# EAGLE design SSOP to DIP 28 pin (EAGLE 5.06)
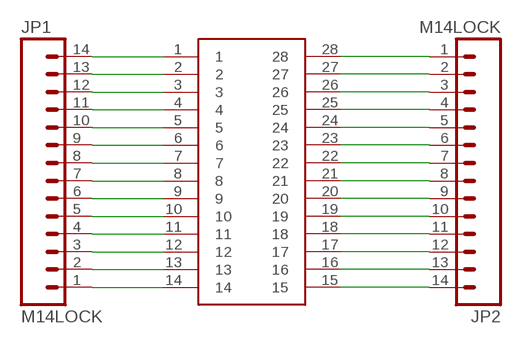
[diagram p0: schematic, sheet 1]

## Parts
JP1  M14LOCK  [1X14_LOCK]
JP2  M14LOCK  [1X14_LOCK]
U$1  SSOP28  [SSOP28DB]

## Nets
N$1: JP2.1 U$1.28
N$2: JP2.2 U$1.27
N$3: JP2.3 U$1.26
N$4: JP2.4 U$1.25
N$5: JP2.5 U$1.24
N$6: JP2.6 U$1.23
N$7: JP2.7 U$1.22
N$8: JP2.8 U$1.21
N$9: JP2.9 U$1.20
N$10: JP2.10 U$1.19
N$11: JP2.11 U$1.18
N$12: JP2.12 U$1.17
N$13: JP2.13 U$1.16
N$14: JP2.14 U$1.15
N$15: JP1.1 U$1.14
N$16: JP1.2 U$1.13
N$17: JP1.3 U$1.12
N$18: JP1.4 U$1.11
N$19: JP1.5 U$1.10
N$20: JP1.6 U$1.9
N$21: JP1.7 U$1.8
N$22: JP1.8 U$1.7
N$23: JP1.9 U$1.6
N$24: JP1.10 U$1.5
N$25: JP1.11 U$1.4
N$26: JP1.12 U$1.3
N$27: JP1.13 U$1.2
N$28: JP1.14 U$1.1

## Library data of the parts
JP1 JP2 = SparkFun:M14: Header 14 Standard 14-pin 0.1" header. Use with straight break away headers (SKU : PRT-00116), right angle break away headers (PRT-00553), swiss pins (PRT-00743), machine pins (PRT-00117), and female headers (PRT-00115).
U$1 = SparkFun:SSOP28

## Board
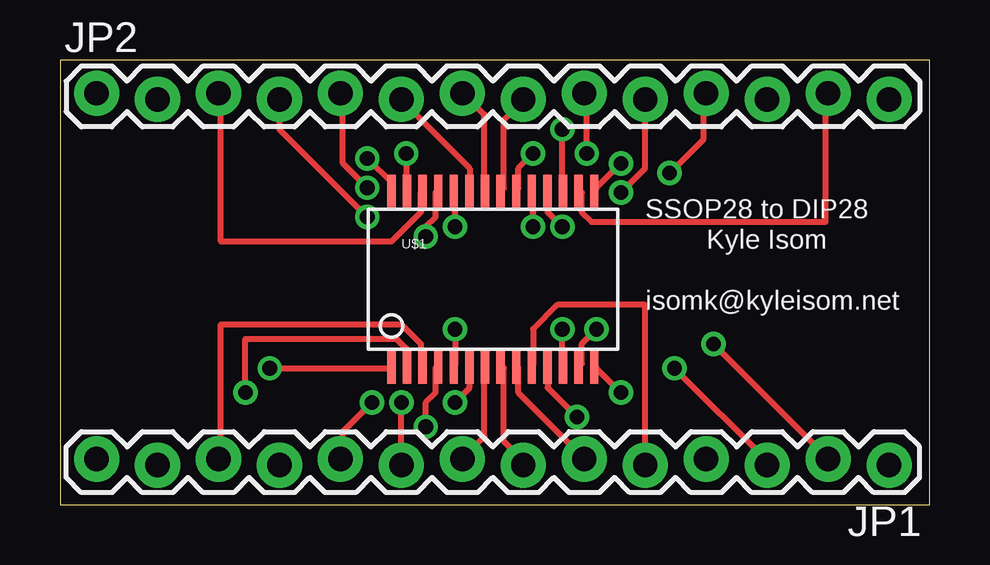
[diagram p1: board, top side]
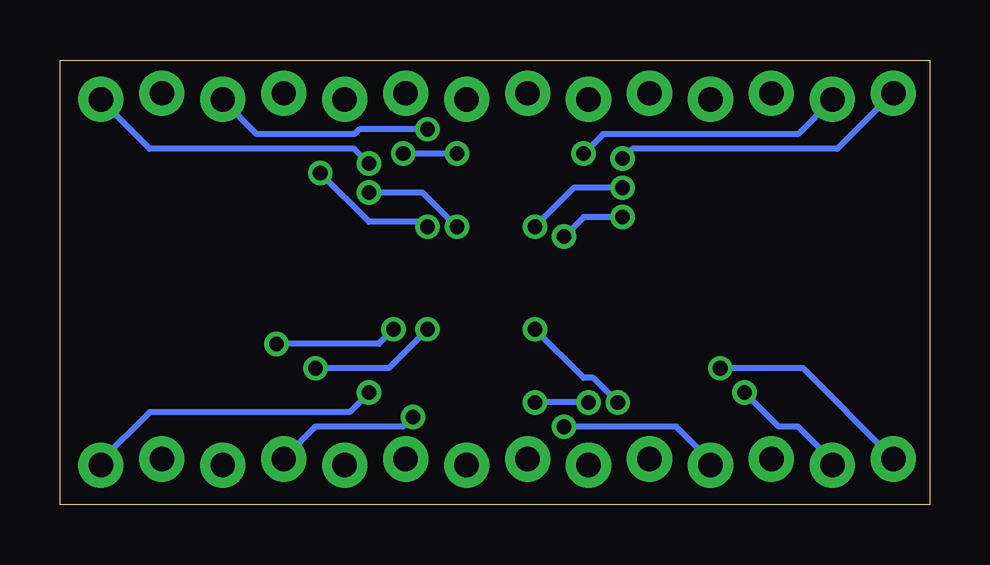
[diagram p2: board, bottom side, seen from below]

Size 36.25 x 18.53 mm. Coordinates in mm from the lower left corner, seen from the top.
Outline: 0,0 36.25,0 36.25,18.53 0,18.53 0,0
Copper layers (1*16): Top 0.035mm / dielectric 1.5mm / Bottom 0.035mm
Design rules "default": minimum track width 10mil, minimum drill 24mil, track to track 8mil, track to pad 8mil, pad to pad 8mil, via to via 8mil, smd to smd 8mil, copper to edge 40mil, drill to drill 8mil, minimum pad ring 10mil, minimum via ring 8mil, stop-mask expansion 4mil, vias tented up to drill 0mil, thermal gap 10mil

### Footprints (pad centres in the part's own frame; a part is rotated, then mirrored left to right if it is on the bottom)
1X14_LOCK = drill 1.016 pad 1.88 round: 1 0,0.127; 2 2.54,-0.127; 3 5.08,0.127; 4 7.62,-0.127; 5 10.16,0.127; 6 12.7,-0.127; 7 15.24,0.127; 8 17.78,-0.127; 9 20.32,0.127; 10 22.86,-0.127; 11 25.4,0.127; 12 27.94,-0.127; 13 30.48,0.127; 14 33.02,-0.127
SSOP28DB = smd 0.348 x 1.397: 1 -4.225,-3.656; 2 -3.575,-3.656; 3 -2.925,-3.656; 4 -2.275,-3.656; 5 -1.625,-3.656; 6 -0.975,-3.656; 7 -0.325,-3.656; 8 0.325,-3.656; 9 0.975,-3.656; 10 1.625,-3.656; 11 2.275,-3.656; 12 2.925,-3.656; 13 3.575,-3.656; 14 4.225,-3.656; 15 4.225,3.656; 16 3.575,3.656; 17 2.925,3.656; 18 2.275,3.656; 19 1.625,3.656; 20 0.975,3.656; 21 0.325,3.656; 22 -0.325,3.656; 23 -0.975,3.656; 24 -1.625,3.656; 25 -2.275,3.656; 26 -2.925,3.656; 27 -3.575,3.656; 28 -4.225,3.656

### Placement (x,y rotation side)
JP1  34.54,1.78 180 top
JP2  1.52,17.02 0 top
U$1  18.03,9.4 0 top

### Tracks (layer width: path | path; a pad name or v marks a point on that pad's centre or on a via)
N$1  (via drill 0.61)
  Top 0.254: v12.8,14.43 13.82,13.41 13.82,13.21 U$1.28
  Bottom 0.254: v12.8,14.43 12.39,14.83 3.86,14.83 1.63,17.07 JP2.1
N$2  (via drill 0.61)
  Top 0.254: v14.43,14.63 14.43,13.21 U$1.27
  Bottom 0.254: v14.43,14.63 13.61,15.44 5.49,15.44 4.06,16.87 JP2.2
N$3
  Top 0.254: U$1.26 15.04,13.01 15.04,12.19 13.82,10.97 6.71,10.97 6.71,17.07 JP2.3
N$4  (via drill 0.61)
  Top 0.254: v15.24,11.18 15.24,11.58 15.65,11.99 15.65,13.01 U$1.25 | v12.8,11.99 9.14,15.65 JP2.4
  Bottom 0.254: v15.24,11.18 14.43,11.99 v12.8,11.99
N$5  (via drill 0.61)
  Top 0.254: v16.46,11.58 16.46,13.01 U$1.24 | v12.8,13.21 11.79,14.22 11.79,17.07 JP2.5
  Bottom 0.254: v16.46,11.58 14.83,13.21 v12.8,13.21
N$6
  Top 0.254: U$1.23 17.07,13.21 17.07,14.02 14.22,16.87 JP2.6
N$7
  Top 0.254: U$1.22 17.68,13.21 17.68,16.26 16.87,17.07 JP2.7
N$8
  Top 0.254: U$1.21 18.49,13.21 18.49,16.05 19.3,16.87 JP2.8
N$9  (via drill 0.61)
  Top 0.254: v19.71,14.63 19.1,14.02 19.1,13.21 U$1.20 | v21.95,14.63 21.95,17.07 JP2.9
  Bottom 0.254: v19.71,14.63 v21.95,14.63
N$10  (via drill 0.61)
  Top 0.254: v19.71,11.58 19.71,13.01 U$1.19 | v23.37,13.01 24.38,14.02 JP2.10
  Bottom 0.254: v19.71,11.58 21.13,13.01 v23.37,13.01
N$11  (via drill 0.61)
  Top 0.254: v20.93,11.58 20.32,12.19 20.32,13.01 U$1.18 | v25.4,13.82 26.82,15.24 26.82,17.07 JP2.11
  Bottom 0.254: v20.93,11.58 21.13,11.79 23.37,11.79 v25.4,13.82
N$12  (via drill 0.61)
  Top 0.254: v20.93,15.65 20.93,13.21 U$1.17
  Bottom 0.254: v20.93,15.65 23.77,15.65 23.98,15.44 28.04,15.44 29.46,16.87 JP2.12
N$13
  Top 0.254: U$1.16 21.74,13.01 21.74,12.19 22.15,11.79 31.9,11.79 31.9,17.07 JP2.13
N$14  (via drill 0.61)
  Top 0.254: v23.37,14.22 22.35,13.21 U$1.15
  Bottom 0.254: v23.37,14.22 23.98,14.83 32.51,14.83 34.54,16.87 JP2.14
N$15  (via drill 0.61)
  Top 0.254: v23.37,4.67 22.35,5.69 U$1.14
  Bottom 0.254: v23.37,4.67 24.18,3.86 32.51,3.86 34.54,1.83 JP1.1
N$16  (via drill 0.61)
  Top 0.254: v22.35,7.32 21.74,6.71 21.74,5.89 U$1.13 | v27.23,6.71 31.9,2.03 JP1.2
  Bottom 0.254: v22.35,7.32 22.96,6.71 v27.23,6.71
N$17  (via drill 0.61)
  Top 0.254: v20.93,7.32 20.93,5.89 U$1.12 | v25.6,5.69 29.46,1.83 JP1.3
  Bottom 0.254: v20.93,7.32 22.55,5.69 v25.6,5.69
N$18  (via drill 0.61)
  Top 0.254: v21.54,3.66 20.32,4.88 20.32,5.69 U$1.11
  Bottom 0.254: v21.54,3.66 21.95,3.25 25.6,3.25 26.82,2.03 JP1.4
N$19
  Top 0.254: U$1.10 19.71,5.89 19.71,7.32 20.73,8.33 24.38,8.33 JP1.5
N$20
  Top 0.254: U$1.9 19.1,5.69 19.1,4.67 21.74,2.03 JP1.6
N$21
  Top 0.254: U$1.8 18.49,5.69 18.49,2.64 19.3,1.83 JP1.7
N$22
  Top 0.254: U$1.7 17.68,5.69 17.68,2.85 16.87,2.03 JP1.8
N$23  (via drill 0.61)
  Top 0.254: v16.46,4.27 17.07,4.88 17.07,5.69 U$1.6 | JP1.9 v14.22,4.27
  Bottom 0.254: v14.22,4.27 v16.46,4.27
N$24  (via drill 0.61)
  Top 0.254: v16.46,7.32 16.46,5.89 U$1.5 | v13.01,4.27 11.79,3.05 11.79,2.03 JP1.10
  Bottom 0.254: v16.46,7.32 14.43,5.28 14.02,5.28 v13.01,4.27
N$25  (via drill 0.61)
  Top 0.254: v15.24,3.25 15.24,4.27 15.65,4.67 15.65,5.69 U$1.4
  Bottom 0.254: v15.24,3.25 10.57,3.25 9.14,1.83 JP1.11
N$26
  Top 0.254: U$1.3 15.04,5.89 15.04,6.71 14.22,7.52 6.71,7.52 6.71,2.03 JP1.12
N$27  (via drill 0.61)
  Top 0.254: v7.72,4.67 7.72,6.91 14.02,6.91 14.43,6.5 14.43,5.89 U$1.2
  Bottom 0.254: v7.72,4.67 6.3,3.25 5.49,3.25 4.06,1.83 JP1.13
N$28  (via drill 0.61)
  Top 0.254: v8.74,5.69 13.82,5.69 U$1.1
  Bottom 0.254: v8.74,5.69 5.28,5.69 1.63,2.03 JP1.14

### Text on the board
tPlace: SSOP28 to DIP28 | Kyle Isom | isomk@kyleisom.net